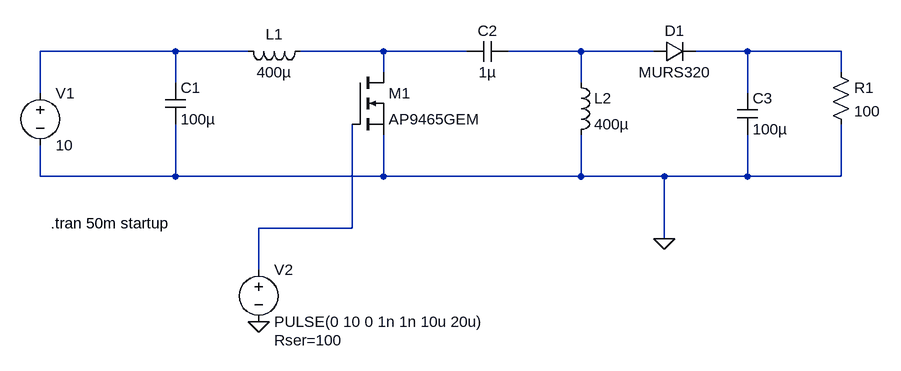
[diagram p0: schematic SEPIC_Convertor.asc]
SEPIC_Convertor.asc, the LTspice schematic file:
Version 4.1
SHEET 1 1044 680
WIRE -48 -16 -256 -16
WIRE 64 -16 -48 -16
WIRE 272 -16 144 -16
WIRE 400 -16 272 -16
WIRE 576 -16 464 -16
WIRE 688 -16 576 -16
WIRE 832 -16 752 -16
WIRE 976 -16 832 -16
WIRE 272 16 272 -16
WIRE 976 16 976 -16
WIRE -48 32 -48 -16
WIRE 576 32 576 -16
WIRE -256 48 -256 -16
WIRE 832 48 832 -16
WIRE -256 176 -256 128
WIRE -48 176 -48 96
WIRE -48 176 -256 176
WIRE 272 176 272 112
WIRE 272 176 -48 176
WIRE 576 176 576 112
WIRE 576 176 272 176
WIRE 704 176 576 176
WIRE 832 176 832 112
WIRE 832 176 704 176
WIRE 976 176 976 96
WIRE 976 176 832 176
WIRE 224 256 224 96
WIRE 224 256 80 256
WIRE 704 272 704 176
WIRE 80 320 80 256
FLAG 704 272 0
FLAG 80 400 0
SYMBOL voltage -256 32 R0
WINDOW 123 0 0 Left 0
WINDOW 39 0 0 Left 0
SYMATTR InstName V1
SYMATTR Value 10
SYMBOL cap -64 32 R0
SYMATTR InstName C1
SYMATTR Value 100µ
SYMBOL ind 160 -32 R90
WINDOW 0 5 56 VBottom 2
WINDOW 3 32 56 VTop 2
SYMATTR InstName L1
SYMATTR Value 400µ
SYMATTR SpiceLine Rser=1m
SYMBOL cap 464 -32 R90
WINDOW 0 0 32 VBottom 2
WINDOW 3 32 32 VTop 2
SYMATTR InstName C2
SYMATTR Value 1µ
SYMBOL ind 560 16 R0
SYMATTR InstName L2
SYMATTR Value 400µ
SYMATTR SpiceLine Rser=1m
SYMBOL diode 688 0 R270
WINDOW 0 32 32 VTop 2
WINDOW 3 0 32 VBottom 2
SYMATTR InstName D1
SYMATTR Value MURS320
SYMBOL cap 816 48 R0
SYMATTR InstName C3
SYMATTR Value 100µ
SYMBOL res 960 0 R0
SYMATTR InstName R1
SYMATTR Value 100
SYMBOL nmos 224 16 R0
SYMATTR InstName M1
SYMATTR Value AP9465GEM
SYMBOL voltage 80 304 R0
WINDOW 123 0 0 Left 0
WINDOW 39 24 124 Left 2
SYMATTR InstName V2
SYMATTR Value PULSE(0 10 0 1n 1n 10u 20u)
SYMATTR SpiceLine Rser=100
TEXT -240 248 Left 2 !.tran 50m startup

The netlist it stands for:
* SEPIC_Convertor.asc
V1 N001 0 10
C1 N001 0 100µ
L1 N002 N001 400µ Rser=1m
C2 N003 N002 1µ
L2 N003 0 400µ Rser=1m
D1 N003 N004 MURS320
C3 N004 0 100µ
R1 N004 0 100
M1 N002 N005 0 0 AP9465GEM
V2 N005 0 PULSE(0 10 0 1n 1n 10u 20u) Rser=100
.model D D
.lib standard.dio
.model NMOS NMOS
.model PMOS PMOS
.lib standard.mos
.tran 50m startup
.backanno
.end